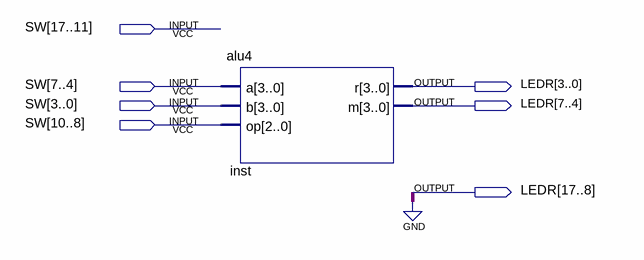
[diagram p0: schematic sheet]
// Quartus schematic ALUDemo.bdf as structural Verilog: 1 symbols, 7 pins
module ALUDemo (
  input  [17:0] SW,
  output [17:0] LEDR
);

  alu4 inst (.a(SW[7:4]), .b(SW[3:0]), .op(SW[10:8]), .r(LEDR[3:0]), .m(LEDR[7:4]));

  assign LEDR[17:8] = {10{1'b0}};
endmodule
